# EAGLE schematic stratum1 (EAGLE 8.3.2)
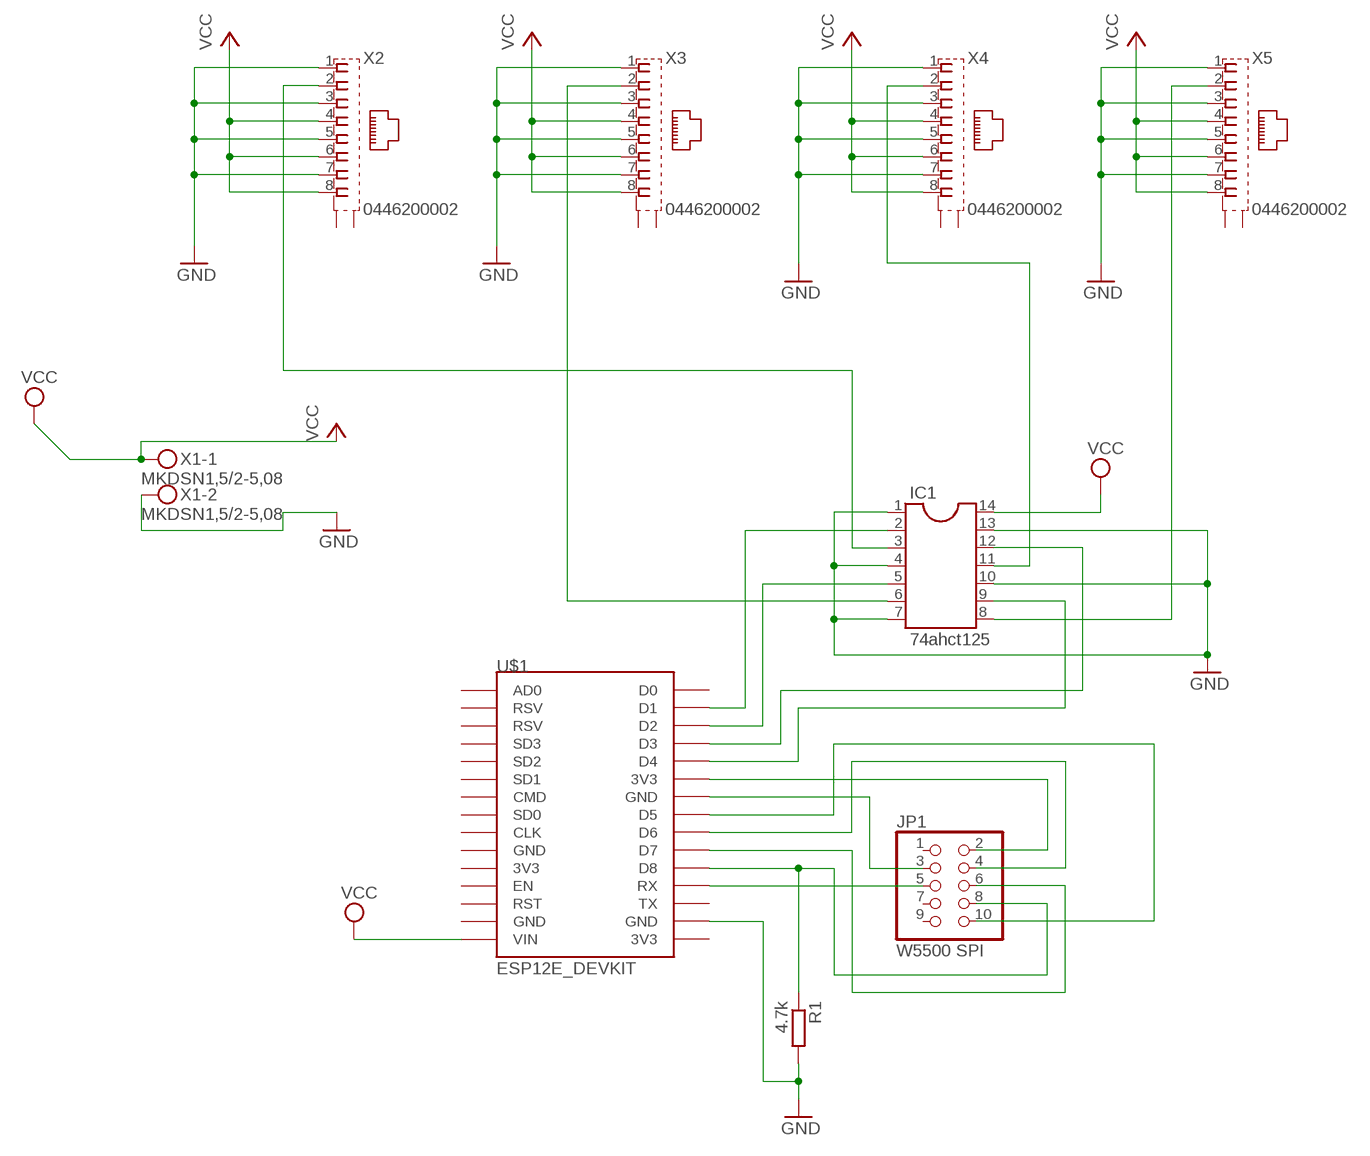
[diagram p0: schematic, sheet 1]

## Parts
IC1  74ahct125  DIL14  [DIL14]
JP1  W5500 SPI  PINHD-2X5  [2X05]
R1  4.7k  R-EU_0207/10  [0207/10]
U$1  ESP12E_DEVKIT  [ESP12E_DEVKIT]
X1  MKDSN1,5/2-5,08  [MKDSN1,5/2-5,08]
X2  0446200002  [0446200002]
X3  0446200002  [0446200002]
X4  0446200002  [0446200002]
X5  0446200002  [0446200002]

## Nets
GND [ground]: IC1.1 IC1.4 IC1.7 IC1.10 IC1.13 R1.2 U$1.GND@3(GND) X1.2 X2.1 X2.3 X2.5 X2.7 X3.1 X3.3 X3.5 X3.7 X4.1 X4.3 X4.5 X4.7 X5.1 X5.3 X5.5 X5.7
N$1: JP1.2 U$1.3V3@1(3V3)
N$2: JP1.3 U$1.GND@2(GND)
N$3: JP1.10 U$1.D5
N$4: JP1.4 U$1.D6
N$5: JP1.6 U$1.D7
N$6: JP1.8 R1.1 U$1.D8
N$7: JP1.5 U$1.RX
N$8: IC1.12 U$1.D3
N$9: IC1.2 U$1.D1
N$10: IC1.5 U$1.D2
N$11: IC1.9 U$1.D4
N$13: IC1.11 X4.2
N$14: IC1.3 X2.2
N$15: IC1.6 X3.2
N$16: IC1.8 X5.2
VCC [vcc]: IC1.14 U$1.VIN X1.1 X2.4 X2.6 X2.8 X3.4 X3.6 X3.8 X4.4 X4.6 X4.8 X5.4 X5.6 X5.8
Unconnected: JP1.1 JP1.7 JP1.9 U$1.3V3@0(3V3) U$1.3V3@2(3V3) U$1.AD0 U$1.CLK U$1.CMD U$1.D0 U$1.EN U$1.GND@0(GND) U$1.GND@1(GND) U$1.RST U$1.RSV@0(RSV) U$1.RSV@1(RSV) U$1.SD0 U$1.SD1 U$1.SD2 U$1.SD3 U$1.TX X2.S@1(S1) X2.S@2(S2) X3.S@1(S1) X3.S@2(S2) X4.S@1(S1) X4.S@2(S2) X5.S@1(S1) X5.S@2(S2)

## Library data of the parts
IC1 = ic-package:DIL14: Dual In Line / Socket; MF: TEXAS INSTRUMENT CONNECTORS; MPN: SN74AHCT125N; OC_NEWARK: 83F8892
JP1 = pinhead:PINHD-2X5: PIN HEADER; OC_NEWARK: unknown
R1 = resistor:R-EU_: RESISTOR, European symbol; MPN: MCWF08P4701FTL; OC_NEWARK: 32AC7849
U$1 = ESP12E_DEVKIT:ESP12E_DEVKIT: ESP12E DEVKIT BOARD; OC_NEWARK: unknown
X1 = con-phoenix-508:MKDSN1,5/2-5,08: MKDSN 1,5/ 2-5,08 Printklemme Nennstrom: 13,5 A Nennspannung: 250 V Rastermaß: 5,08 mm Polzahl: 2 Anschlussart: Schraubanschluss Montage: Löten Anschlussrichtung Leiter/Platine: 0 ° Artikelnummer: 1729128 Source: http://eshop.phoenixcontact.com .. 1729128.pdf; OC_NEWARK: unknown
X2-X5 = con-molex:0446200002: RJ-45 INVERTED MODULAR JACK ASSEMBLY WITH RJ-11 KEEPOUT FEATURE Source: Data sheet <http://www.farnell.com/datasheets/73207.pdf> MOLEX 0446200002 BUCHSE, RJ45, GESCHIRMT Source: Farnell <http://de.farnell.com/molex/0446200002/buchse-rj45-geschirmt/dp/9251910?ost=9251910>; MF: FARNELL; MPN: 0446200002; OC_FARNELL: 9251910; OC_NEWARK: 38K9904

## Net classes
1 ground: width 0.127 mm
2 vcc: width 0.127 mm